# EAGLE schematic 18650station (EAGLE 7.6.0)
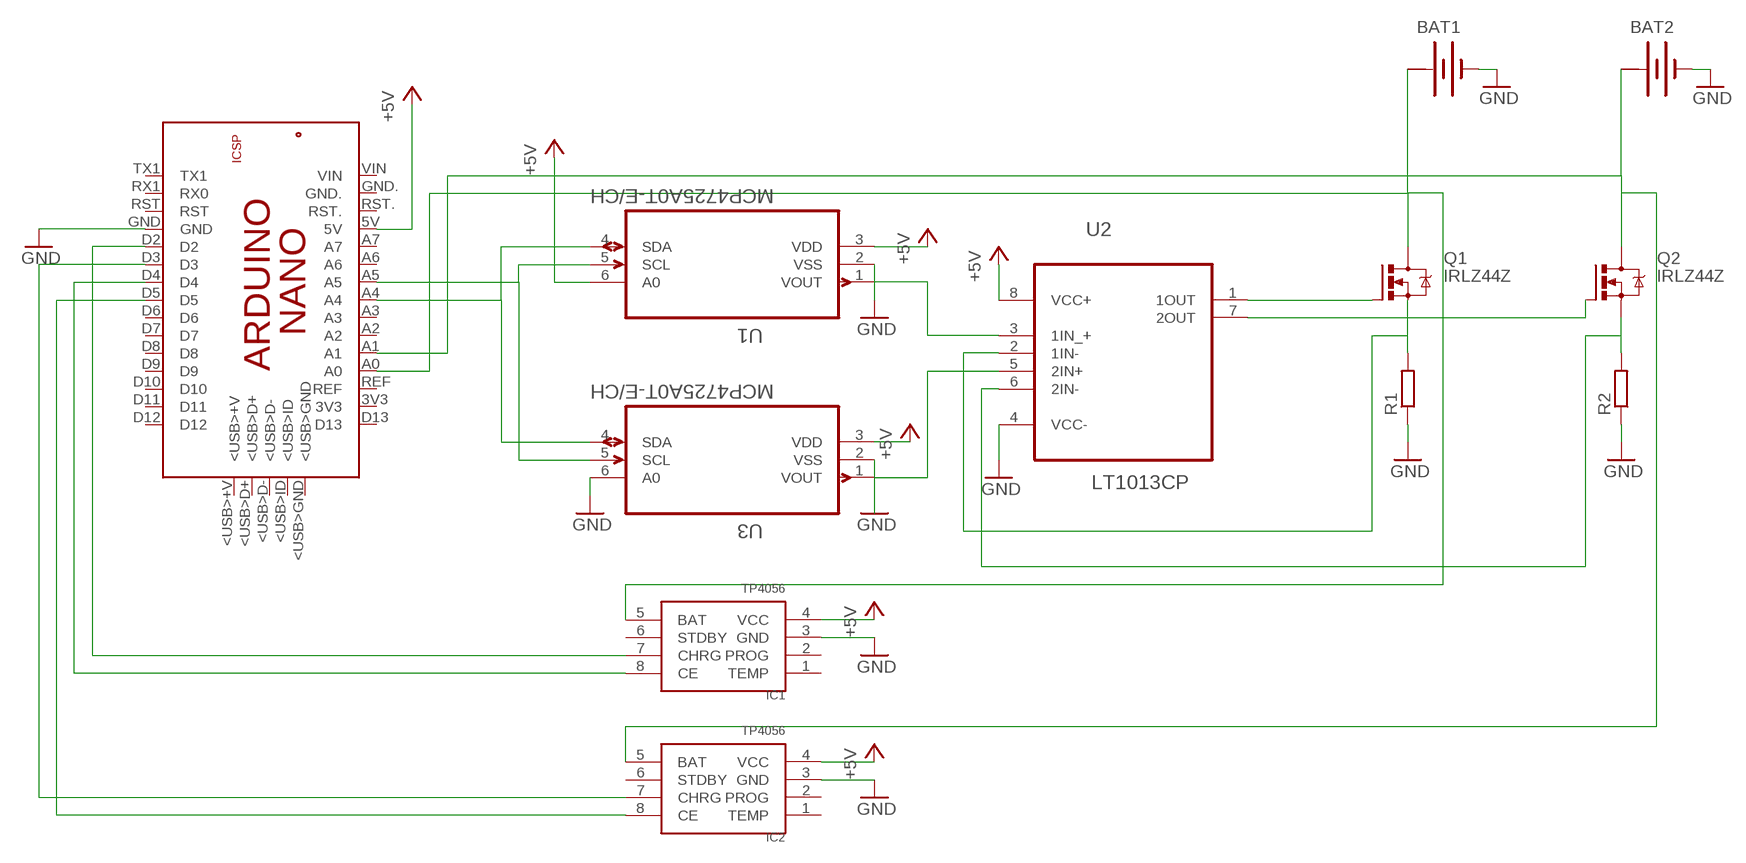
[diagram p0: schematic, sheet 1]

## Parts
BAT1  BATTERY  [BATTERY]
BAT2  BATTERY  [BATTERY]
IC1  TP4056  [SOP-8]
IC2  TP4056  [SOP-8]
PCB1  ARDUINO_NANO  [ARDUINO_NANO]
Q1  IRLZ44Z  [TO220BH]
Q2  IRLZ44Z  [TO220BH]
R1  R-EU_0207/10  [0207/10]
R2  R-EU_0207/10  [0207/10]
U1  MCP4725A0T-E/CH  [SOT95P270X145-6N]
U2  LT1013CP  [DIP254P762X508-8]
U3  MCP4725A0T-E/CH  [SOT95P270X145-6N]

## Nets
+5V: IC1.4(VCC) IC2.4(VCC) PCB1.5V U1.3(VDD) U1.6(A0) U2.8(VCC+) U3.3(VDD)
GND: BAT1.- BAT2.- IC1.3(GND) IC2.3(GND) PCB1.GND R1.1 R2.1 U1.2(VSS) U2.4(VCC-) U3.6(A0)
N$1: PCB1.A4 U1.4(SDA) U3.4(SDA)
N$2: PCB1.A5 U1.5(SCL) U3.5(SCL)
N$3: U2.5(2IN+) U3.1(VOUT)
N$4: U1.1(VOUT) U2.3(1IN_+)
N$5: Q1.G U2.1(1OUT)
N$6: Q2.G R1.2 U2.2(1IN-) U2.7(2OUT)
N$7: Q2.S R2.2 U2.6(2IN-)
N$8: IC1.7(CHRG) PCB1.D2
N$9: IC1.8(CE) PCB1.D4
N$10: BAT2.+ IC2.5(BAT) PCB1.A1 Q2.D
N$11: BAT1.+ IC1.5(BAT) PCB1.A0 Q1.D
N$12: IC2.7(CHRG) PCB1.D3
N$13: IC2.8(CE) PCB1.D5
N$16: U3.2(VSS)
Unconnected: IC1.1(TEMP) IC1.2(PROG) IC1.6(STDBY) IC2.1(TEMP) IC2.2(PROG) IC2.6(STDBY) PCB1.3V3 PCB1.5V. PCB1.<USB>+V PCB1.<USB>D+ PCB1.<USB>D- PCB1.<USB>GND PCB1.<USB>ID PCB1.A2 PCB1.A3 PCB1.A6 PCB1.A7 PCB1.D6 PCB1.D7 PCB1.D8 PCB1.D9 PCB1.D10 PCB1.D11 PCB1.D12 PCB1.D13 PCB1.GND. PCB1.GND_ PCB1.MISO PCB1.MOSI PCB1.REF PCB1.RESET.. PCB1.RST PCB1.RST. PCB1.RX1(RX0) PCB1.SCK PCB1.TX1 PCB1.VIN Q1.S

## Power pins joined to a net without a drawn wire
+: BAT1.+@1(+) BAT2.+@1(+)

## Library data of the parts
BAT1 BAT2 = special:BATTERY: BATTERY
IC1 IC2 = TP4056:TP4056
PCB1 = E14_Arduino_revC:ARDUINO_NANO: Device for representing an Arduino Nano board with a footprint in an EAGLE design. Created by Dave Young for Element14. More EAGLE documentation at: http://www.element14.com/community/community/knode/cadsoft_eagle
Q1 Q2 = transistor-power:IRLZ44Z: N-Channel HEXFET® Power MOSFET Logic Level AUTOMOTIVE MOSFET Source: http://www.irf.com/product-info/datasheets/data/irlz44zpbf.pdf
R1 R2 = resistor:R-EU_: RESISTOR, European symbol
U1 U3 = Microchip_By_element14_Batch_1:MCP4725A0T-E/CH: 12-Bit Digital-to-Analog Converter with EEPROM; MPN: MCP4725A0T-E/CH; OC_FARNELL: 1578449; OC_NEWARK: 77M3032; PACKAGE: SOT-23-6; SUPPLIER: Microchip
U2 = Texas Instruments_By_element14_Batch_1:LT1013CP: OPERATIONAL AMPLIFIER; MPN: LT1013CP; OC_FARNELL: 1470376; OC_NEWARK: 60K6194; PACKAGE: PDIP; SUPPLIER: Texas Instruments